# EAGLE schematic Control amp (EAGLE 7.2.0)
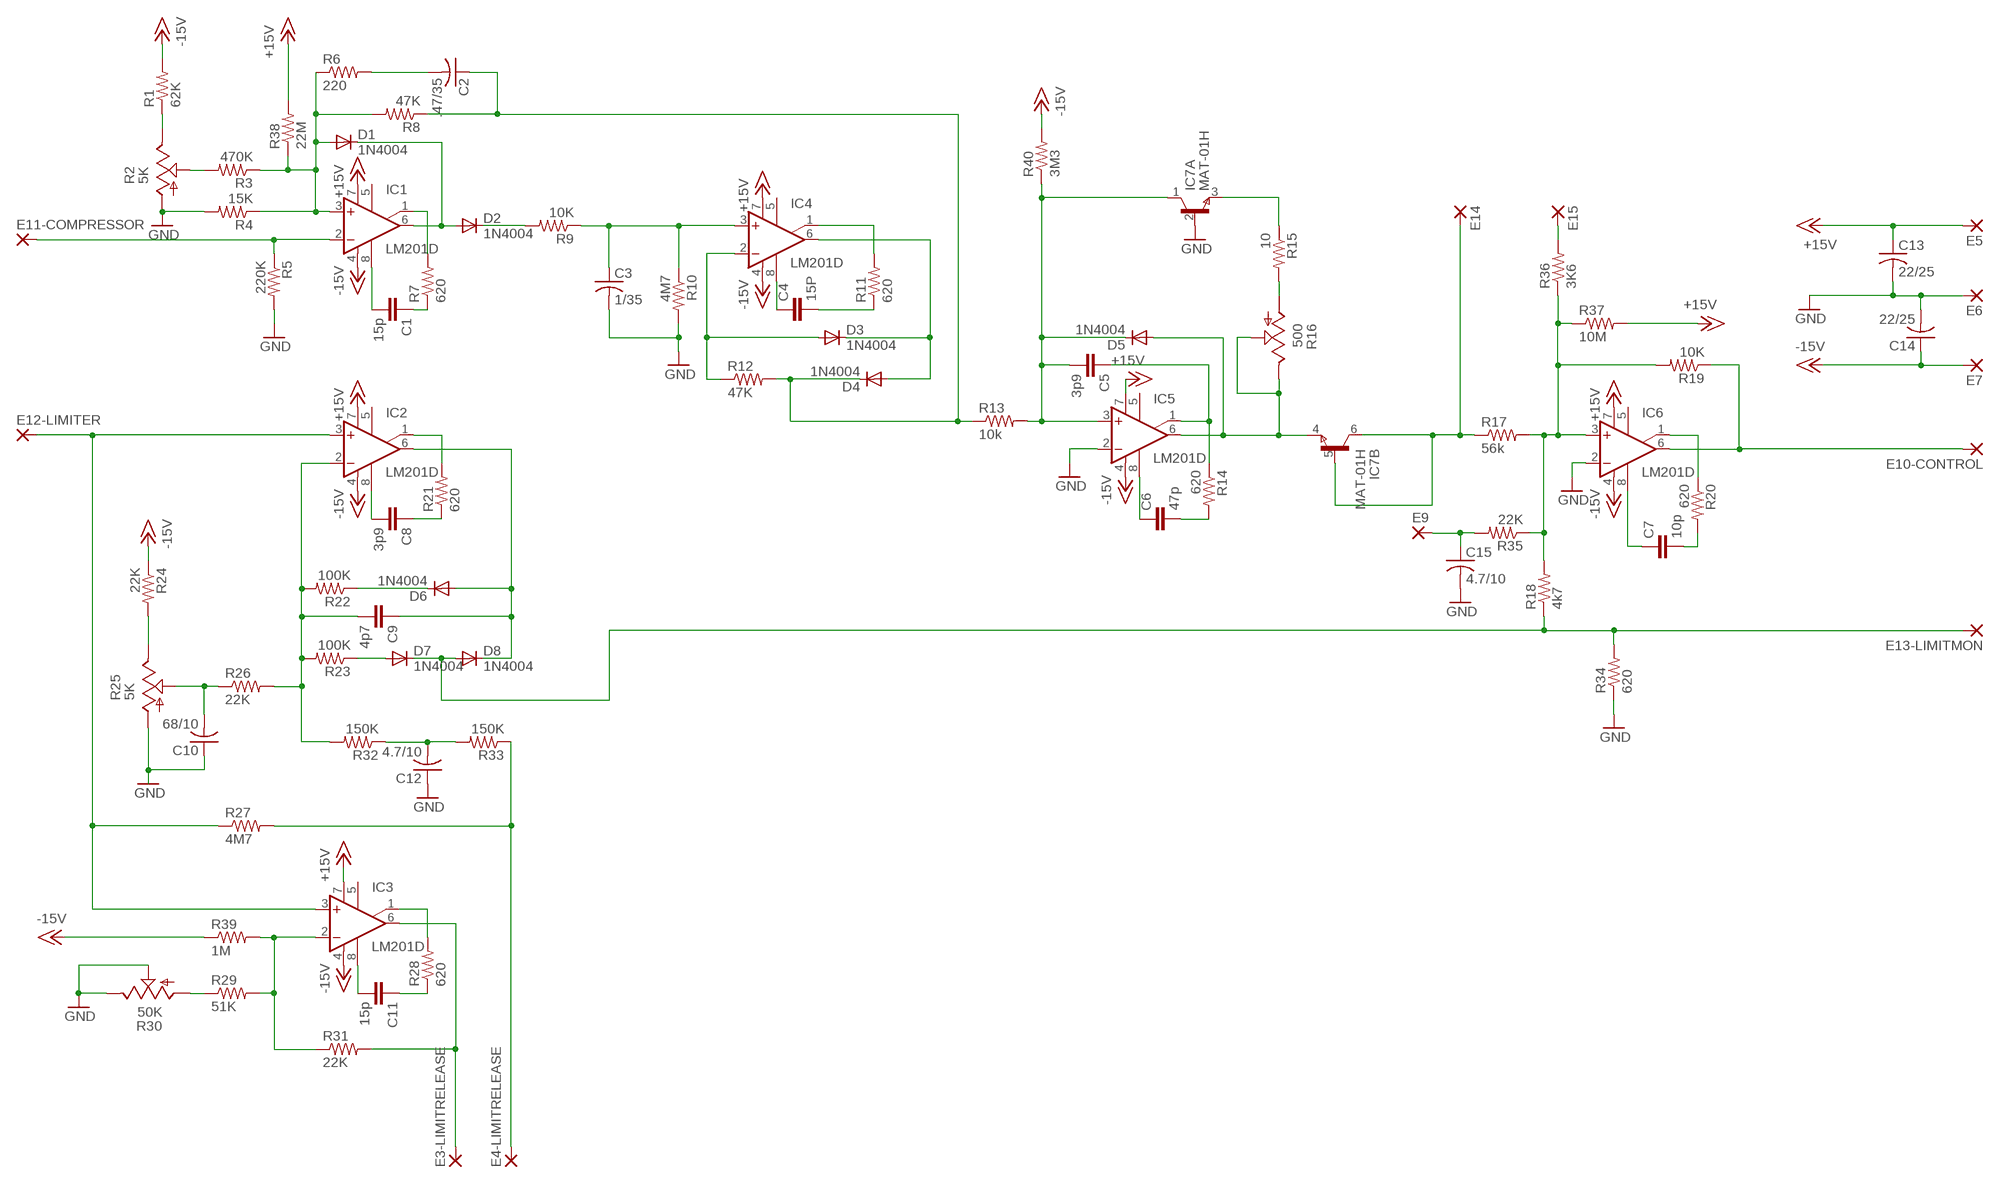
[diagram p0: schematic, sheet 1]

## Parts
C1  15p  C2.5/5  [C2.5-5]
C2  .47/35  C-USC0805  [C0805]
C3  1/35  C-USC0805  [C0805]
C4  15P  C2.5/5  [C2.5-5]
C5  3p9  C2.5/5  [C2.5-5]
C6  47p  C2.5/5  [C2.5-5]
C7  10p  C2.5/5  [C2.5-5]
C8  3p9  C2.5/5  [C2.5-5]
C9  4p7  C2.5/5  [C2.5-5]
C10  68/10  C-USC0805  [C0805]
C11  15p  C2.5/5  [C2.5-5]
C12  4.7/10  C-USC0805  [C0805]
C13  22/25  C-USC0805  [C0805]
C14  22/25  C-USC0805  [C0805]
C15  4.7/10  C-USC0805  [C0805]
D1  1N4004  [DO41-10]
D2  1N4004  [DO41-10]
D3  1N4004  [DO41-10]
D4  1N4004  [DO41-10]
D5  1N4004  [DO41-10]
D6  1N4004  [DO41-10]
D7  1N4004  [DO41-10]
D8  1N4004  [DO41-10]
E3-LIMITRELEASE  SMD2  [SMD1,27-2,54]
E4-LIMITRELEASE  SMD2  [SMD1,27-2,54]
E5  SMD2  [SMD1,27-2,54]
E6  SMD2  [SMD1,27-2,54]
E7  SMD2  [SMD1,27-2,54]
E9  SMD2  [SMD1,27-2,54]
E10-CONTROL  SMD2  [SMD1,27-2,54]
E11-COMPRESSOR  SMD2  [SMD1,27-2,54]
E12-LIMITER  SMD2  [SMD1,27-2,54]
E13-LIMITMON  SMD2  [SMD1,27-2,54]
E14  SMD2  [SMD1,27-2,54]
E15  SMD2  [SMD1,27-2,54]
IC1  LM201D  [SO08]
IC2  LM201D  [SO08]
IC3  LM201D  [SO08]
IC4  LM201D  [SO08]
IC5  LM201D  [SO08]
IC6  LM201D  [SO08]
IC7  MAT-01H  [TO78]
R1  62K  R-US_R0805  [R0805]
R2  5K  TRIM_US-3223G  [3223G]
R3  470K  R-US_R0805  [R0805]
R4  15K  R-US_R0805  [R0805]
R5  220K  R-US_R0805  [R0805]
R6  220  R-US_R0805  [R0805]
R7  620  R-US_R0805  [R0805]
R8  47K  R-US_R0805  [R0805]
R9  10K  R-US_R0805  [R0805]
R10  4M7  R-US_R0805  [R0805]
R11  620  R-US_R0805  [R0805]
R12  47K  R-US_R0805  [R0805]
R13  10k  R-US_R0805  [R0805]
R14  620  R-US_R0805  [R0805]
R15  10  R-US_R0805  [R0805]
R16  500  TRIM_US-3223G  [3223G]
R17  56k  R-US_R0805  [R0805]
R18  4k7  R-US_R0805  [R0805]
R19  10K  R-US_R0805  [R0805]
R20  620  R-US_R0805  [R0805]
R21  620  R-US_R0805  [R0805]
R22  100K  R-US_R0805  [R0805]
R23  100K  R-US_R0805  [R0805]
R24  22K  R-US_R0805  [R0805]
R25  5K  TRIM_US-3223G  [3223G]
R26  22K  R-US_R0805  [R0805]
R27  4M7  R-US_R0805  [R0805]
R28  620  R-US_R0805  [R0805]
R29  51K  R-US_R0805  [R0805]
R30  50K  TRIM_US-3223G  [3223G]
R31  22K  R-US_R0805  [R0805]
R32  150K  R-US_R0805  [R0805]
R33  150K  R-US_R0805  [R0805]
R34  620  R-US_R0805  [R0805]
R35  22K  R-US_R0805  [R0805]
R36  3K6  R-US_R0805  [R0805]
R37  10M  R-US_R0805  [R0805]
R38  22M  R-US_R0805  [R0805]
R39  1M  R-US_R0805  [R0805]
R40  3M3  R-US_R0805  [R0805]

## Nets
+15V: C13.1 E5.1(P) IC1.7(V+) IC2.7(V+) IC3.7(V+) IC4.7(V+) IC5.7(V+) IC6.7(V+) R37.2 R38.2
-16V: C14.1 E7.1(P) IC1.4(V-) IC2.4(V-) IC3.4(V-) IC4.4(V-) IC5.4(V-) IC6.4(V-) R1.2 R24.1 R39.1 R40.2 ; supply symbol labelled -15V
GND: C3.2 C10.1 C12.1 C13.2 C14.2 C15.2 E6.1(P) IC5.2(-IN) IC6.2(-IN) IC7.2(A:B) R2.1(A) R4.2 R5.2 R10.2 R25.1(A) R30.2(S) R30.3(E) R34.1
N$1: R1.1 R2.3(E)
N$2: R2.2(S) R3.2
N$3: C2.1 D4.C R8.1 R12.2 R13.1
N$4: C2.2 R6.2
N$5: D5.A IC5.6(OUT) IC7.4(B:E) R16.2(S) R16.3(E)
N$6: E11-COMPRESSOR.1(P) IC1.2(-IN) R5.1
N$7: D1.A IC1.3(+IN) R3.1 R4.1 R6.1 R8.2 R38.1
N$8: D2.C R9.2
N$9: C1.1 R7.1
N$10: C1.2 IC1.8(CMP)
N$11: IC1.1(ON/CMP) R7.2
N$12: D1.C D2.A IC1.6(OUT)
N$13: C3.1 IC4.3(+IN) R9.1 R10.1
N$14: C6.2 R14.2
N$15: D3.A IC4.2(-IN) R12.1
N$16: D3.C D4.A IC4.6(OUT)
N$17: C6.1 IC5.8(CMP)
N$18: C5.2 D5.C IC5.3(+IN) IC7.1(A:C) R13.2 R40.1
N$19: C4.1 IC4.8(CMP)
N$20: C4.2 R11.1
N$21: IC4.1(ON/CMP) R11.2
N$22: R15.2 R16.1(A)
N$23: IC7.3(A:E) R15.1
N$24: C5.1 IC5.1(ON/CMP) R14.1
N$25: C7.2 R20.2
N$26: IC6.3(+IN) R17.2 R18.2 R19.2 R35.1 R36.1 R37.1
N$27: E14.1(P) IC7.5(B:B) IC7.6(B:C) R17.1
N$28: D7.C D8.A E13-LIMITMON.1(P) R18.1 R34.2
N$29: IC6.1(ON/CMP) R20.1
N$30: E10-CONTROL.1(P) IC6.6(OUT) R19.1
N$31: C7.1 IC6.8(CMP)
N$32: E15.1(P) R36.2
N$33: C15.1 E9.1(P) R35.2
N$34: IC2.1(ON/CMP) R21.2
N$35: C8.1 R21.1
N$36: C8.2 IC2.8(CMP)
N$37: E12-LIMITER.1(P) IC2.3(+IN) IC3.3(+IN) R27.1
N$38: C9.1 D6.A D8.C IC2.6(OUT)
N$39: D6.C R22.1
N$40: C9.2 IC2.2(-IN) R22.2 R23.2 R26.2 R32.2
N$41: C11.2 IC3.8(CMP)
N$42: D7.A R23.1
N$43: R24.2 R25.3(E)
N$44: E4-LIMITRELEASE.1(P) R27.2 R33.1
N$45: C10.2 R25.2(S) R26.1
N$46: C11.1 R28.1
N$47: IC3.1(ON/CMP) R28.2
N$48: E3-LIMITRELEASE.1(P) IC3.6(OUT) R31.2
N$49: C12.2 R32.1 R33.2
N$50: R29.1 R30.1(A)
N$52: IC3.2(-IN) R29.2 R31.1 R39.2
Unconnected: IC1.5(ON) IC2.5(ON) IC3.5(ON) IC4.5(ON) IC5.5(ON) IC6.5(ON)

## Library data of the parts
C1 C4-C9 C11 = capacitor-wima:C: CAPACITOR naming: grid - package width
C2 C3 C10 C12-C15 = adafruit:C-US: CAPACITOR, American symbol
D1-D8 = diode:1N4004: DIODE general purpose rectifier, 1 A
E3-LIMITRELEASE E4-LIMITRELEASE E5-E7 E9 E10-CONTROL E11-COMPRESSOR E12-LIMITER E13-LIMITMON E14 E15 = wirepad:SMD2: SMD PAD
IC1-IC6 = linear:LM201: OP AMP
IC7 = linear:MAT-01H: Dual TRANSISTOR
R1 R3-R15 R17-R24 R26-R29 R31-R40 = adafruit:R-US_: RESISTOR, American symbol
R2 R16 R25 R30 = pot:TRIM_US-: POTENTIOMETER